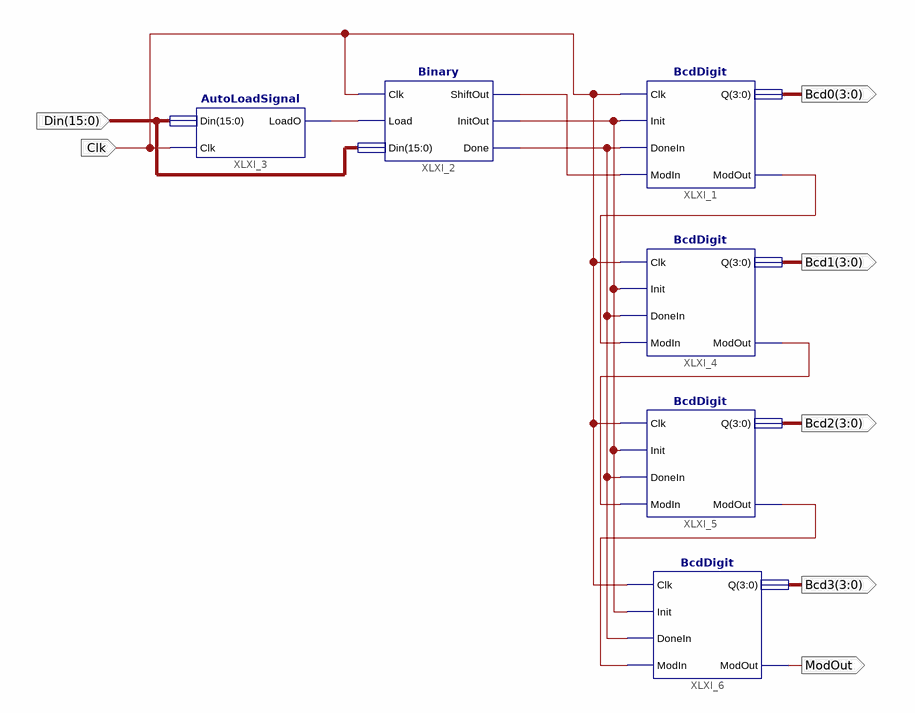
[diagram p0: schematic sheet 1]
// Xilinx ISE schematic BinaryTBcd.sch (spartan3e) as structural Verilog: 6 symbols, 7 ports
module BinaryTBcd (
  input  Clk,
  input  [15:0] Din,
  output [3:0] Bcd0,
  output [3:0] Bcd1,
  output [3:0] Bcd2,
  output [3:0] Bcd3,
  output ModOut
);

  wire XLXN_6, XLXN_11, XLXN_14, XLXN_20, XLXN_21, XLXN_22, XLXN_23;

  BcdDigit XLXI_1 (.Clk(Clk), .Init(XLXN_11), .DoneIn(XLXN_14), .ModIn(XLXN_23), .Q(Bcd0), .ModOut(XLXN_20));
  Binary XLXI_2 (.Clk(Clk), .Load(XLXN_6), .Din(Din), .ShiftOut(XLXN_23), .InitOut(XLXN_11), .Done(XLXN_14));
  AutoLoadSignal XLXI_3 (.Clk(Clk), .LoadO(XLXN_6), .Din(Din));
  BcdDigit XLXI_4 (.Clk(Clk), .Init(XLXN_11), .DoneIn(XLXN_14), .ModIn(XLXN_20), .Q(Bcd1), .ModOut(XLXN_22));
  BcdDigit XLXI_5 (.Clk(Clk), .Init(XLXN_11), .DoneIn(XLXN_14), .ModIn(XLXN_22), .Q(Bcd2), .ModOut(XLXN_21));
  BcdDigit XLXI_6 (.Clk(Clk), .Init(XLXN_11), .DoneIn(XLXN_14), .ModIn(XLXN_21), .Q(Bcd3), .ModOut(ModOut));
endmodule
